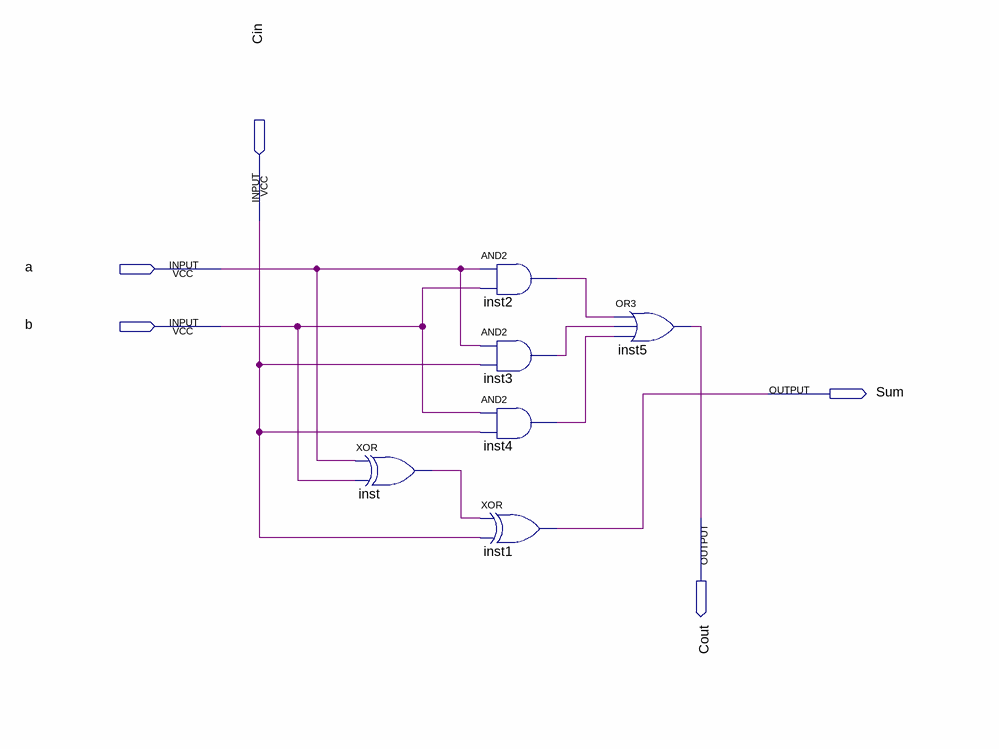
[diagram p0: schematic sheet]
// Quartus schematic fulladder.bdf as structural Verilog: 6 symbols, 5 pins
module fulladder (
  input  Cin,
  input  a,
  input  b,
  output Sum,
  output Cout
);

  wire inst2_out, inst3_out, inst4_out, inst_out;

  xor inst (inst_out, a, b);
  and inst2 (inst2_out, a, b);
  and inst3 (inst3_out, a, Cin);
  and inst4 (inst4_out, b, Cin);
  xor inst1 (Sum, inst_out, Cin);
  or inst5 (Cout, inst2_out, inst3_out, inst4_out);
endmodule
